# EAGLE schematic ardu_uno_car (EAGLE 7.7.0)
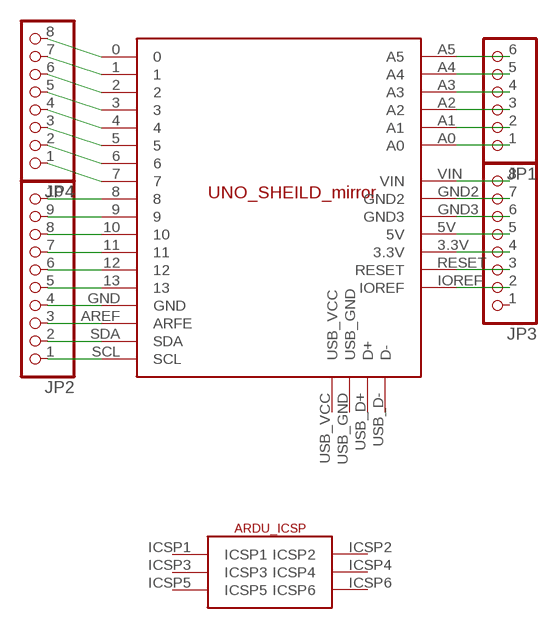
[diagram p0: schematic, sheet 1]

## Parts
JP1  PINHEAD_PINHD-1X6  [PINHEAD_1X06]
JP2  PINHD-1X10  [1X10]
JP3  PINHEAD_PINHD-1X8  [PINHEAD_1X08]
JP4  PINHEAD_PINHD-1X8  [PINHEAD_1X08]
U$1  UNO_SHEILD_MIRROR_CH_VER  [UNO_SHEILD_MIRROR_CH_VER]

## Nets
N$1: JP2.1 U$1.SCL
N$2: JP2.2 U$1.SDA
N$3: JP2.3 U$1.AREF(ARFE)
N$4: JP2.4 U$1.GND
N$5: JP2.5 U$1.13
N$6: JP2.6 U$1.12
N$7: JP2.7 U$1.11
N$8: JP2.8 U$1.10
N$9: JP2.9 U$1.9
N$10: JP2.10 U$1.8
N$11: JP4.1 U$1.7
N$12: JP4.2 U$1.6
N$13: JP4.3 U$1.5
N$14: JP4.4 U$1.4
N$15: JP4.5 U$1.3
N$16: JP4.6 U$1.2
N$17: JP4.7 U$1.1
N$18: JP4.8 U$1.0
N$19: JP1.1 U$1.A0
N$20: JP1.2 U$1.A1
N$21: JP1.3 U$1.A2
N$22: JP1.4 U$1.A3
N$23: JP1.5 U$1.A4
N$24: JP1.6 U$1.A5
N$25: JP3.2 U$1.IOREF
N$26: JP3.3 U$1.RESET
N$27: JP3.4 U$1.3.3V
N$28: JP3.5 U$1.5V
N$29: JP3.6 U$1.GND3
N$30: JP3.7 U$1.GND2
N$31: JP3.8 U$1.VIN
Unconnected: JP3.1 U$1.ICSP1 U$1.ICSP2 U$1.ICSP3 U$1.ICSP4 U$1.ICSP5 U$1.ICSP6 U$1.USB_D+(D+) U$1.USB_D-(D-) U$1.USB_GND U$1.USB_VCC

## Library data of the parts
JP1 = arduino_Uno_ref:PINHEAD_PINHD-1X6: PIN HEADER
JP2 = pinhead:PINHD-1X10: PIN HEADER
JP3 JP4 = arduino_Uno_ref:PINHEAD_PINHD-1X8: PIN HEADER
U$1 = UNO_sheild:UNO_SHEILD_MIRROR_CH_VER